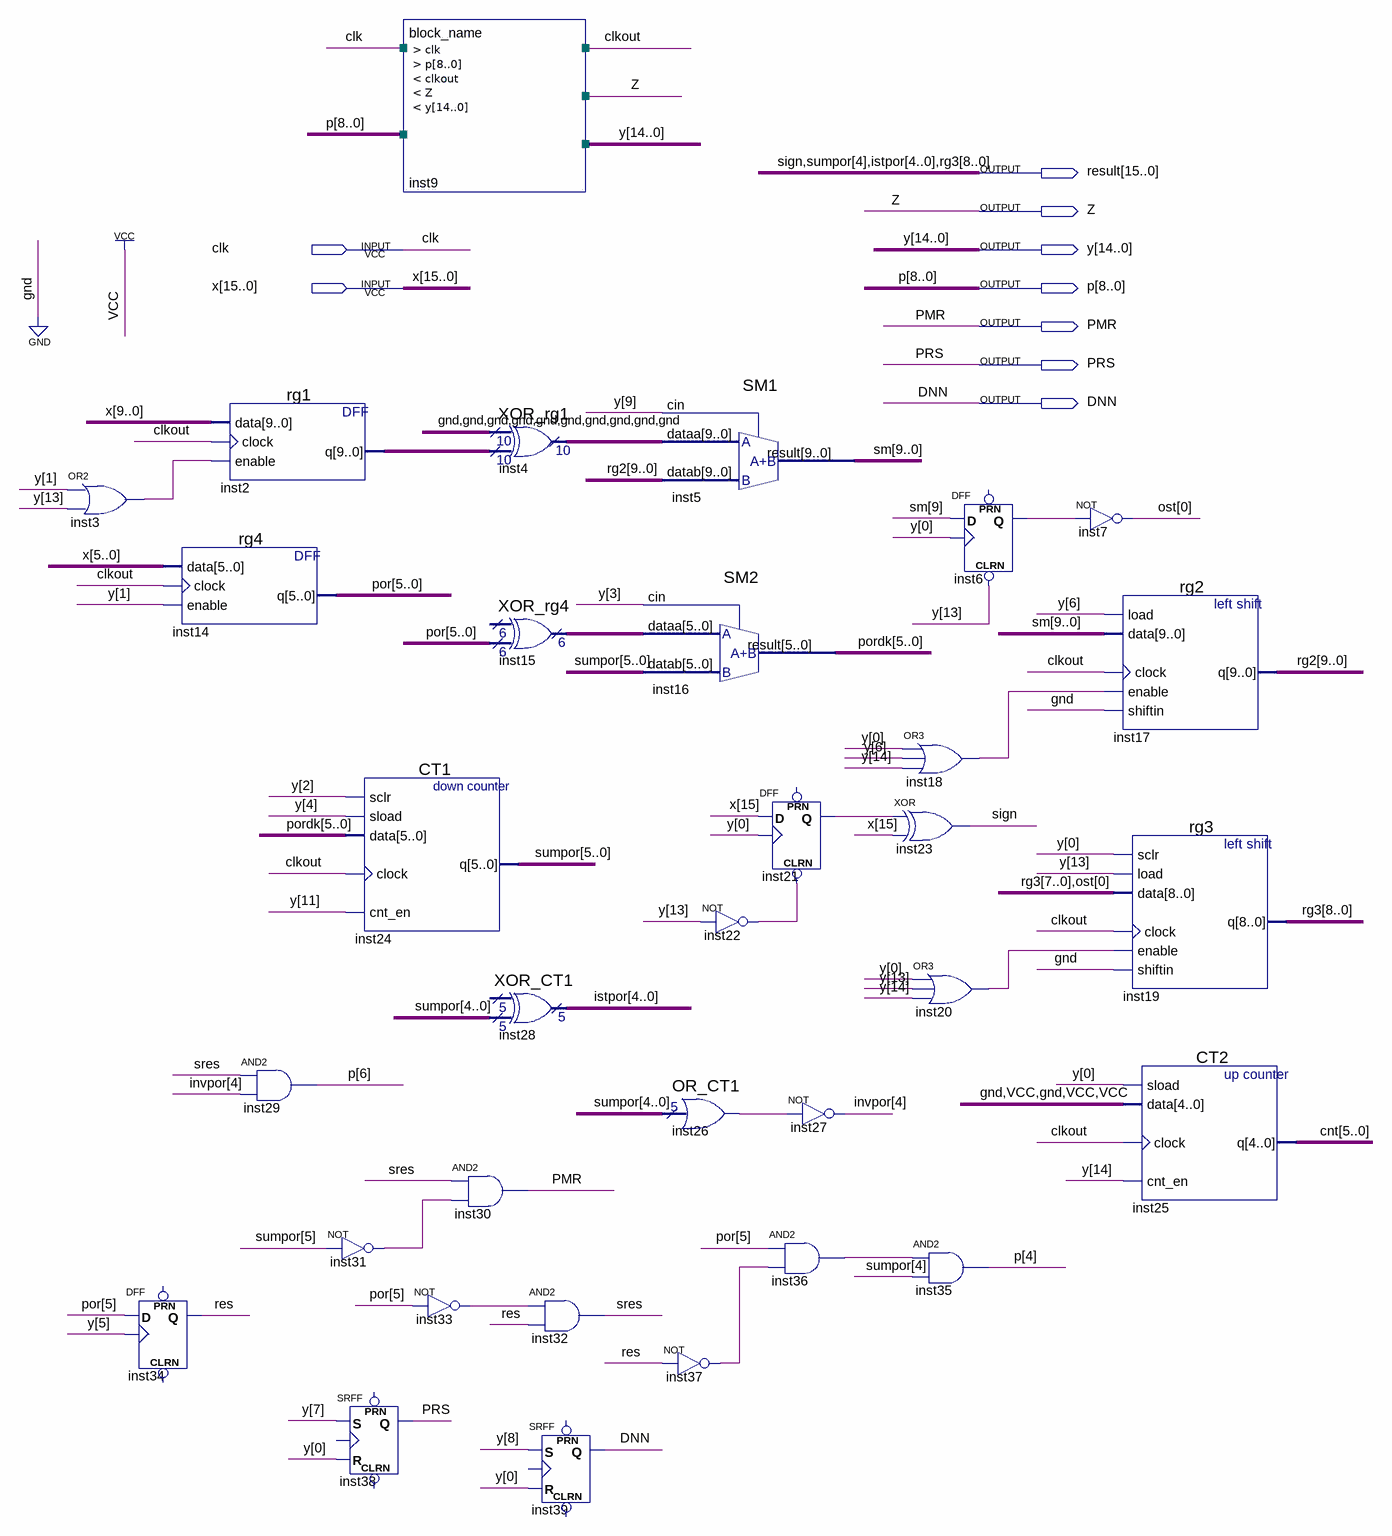
[diagram p0: schematic sheet]
// Quartus schematic kk.bdf as structural Verilog: 33 symbols, 9 pins
module kk (
  input  clk,
  input  [15:0] x,
  output [15:0] result,
  output Z,
  output [14:0] y,
  output [8:0] p,
  output PMR,
  output PRS,
  output DNN
);

  wire clkout, inst3_out, inst6_q, inst18_out, inst20_out, inst21_q, inst22_out, inst26_result, inst31_out,
       inst33_out, inst36_out, inst37_out, res, sres;
  wire [0:0] ost;
  wire [4:4] invpor;
  wire [5:0] cnt, inst15_result, por, pordk, sumpor;
  wire [9:0] inst2_q, inst4_result, rg2, sm;

  or inst3 (inst3_out, y[1], y[13]);
  rg4 inst14 (.data(x[5:0]), .clock(clkout), .enable(y[1]), .q(por));
  DFF inst34 (.CLK(y[5]), .D(por[5]), .Q(res));  // open: CLRN, PRN
  rg1 inst2 (.data(x[9:0]), .clock(clkout), .enable(inst3_out), .q(inst2_q));
  and inst29 (p[6], sres, invpor[4]);
  CT1 inst24 (
    .sclr(y[2]), .sload(y[4]), .data(pordk), .clock(clkout), .cnt_en(y[11]),
    .q({sumpor[5], result[14], sumpor[3:0]}));
  not inst31 (inst31_out, sumpor[5]);
  SRFF inst38 (.S(y[7]), .R(y[0]), .Q(PRS));  // open: PRN, CLRN, CLK
  block_name inst9 (.clk(clk), .p(p), .clkout(clkout), .Z(Z), .y(y));
  and inst30 (PMR, sres, inst31_out);
  not inst33 (inst33_out, por[5]);
  XOR_rg1 inst4 (.data0x({10{1'b0}}), .data1x(inst2_q), .result(inst4_result));
  XOR_rg4 inst15 (.data1x(por), .result(inst15_result));  // open: data0x
  XOR_CT1 inst28 (.data1x({result[14], sumpor[3:0]}), .result(result[13:9]));  // open: data0x
  and inst32 (sres, inst33_out, res);
  SRFF inst39 (.S(y[8]), .R(y[0]), .Q(DNN));  // open: PRN, CLRN, CLK
  SM1 inst5 (.dataa(inst4_result), .datab(rg2), .cin(y[9]), .result(sm));
  SM2 inst16 (.dataa(inst15_result), .datab({sumpor[5], result[14], sumpor[3:0]}), .cin(y[3]), .result(pordk));
  not inst22 (inst22_out, y[13]);
  OR_CT1 inst26 (.data({result[14], sumpor[3:0]}), .result(inst26_result));
  not inst37 (inst37_out, res);
  DFF inst21 (.CLRN(inst22_out), .CLK(y[0]), .D(x[15]), .Q(inst21_q));  // open: PRN
  and inst36 (inst36_out, por[5], inst37_out);
  not inst27 (invpor[4], inst26_result);
  or inst18 (inst18_out, y[0], y[6], y[14]);
  xor inst23 (result[15], inst21_q, x[15]);
  or inst20 (inst20_out, y[0], y[13], y[14]);
  and inst35 (p[4], inst36_out, result[14]);
  DFF inst6 (.CLRN(y[13]), .CLK(y[0]), .D(sm[9]), .Q(inst6_q));  // open: PRN
  not inst7 (ost[0], inst6_q);
  rg2 inst17 (.load(y[6]), .data(sm), .clock(clkout), .enable(inst18_out), .shiftin(1'b0), .q(rg2));
  rg3 inst19 (
    .sclr(y[0]), .load(y[13]), .data({result[7:0], ost[0]}), .clock(clkout), .enable(inst20_out),
    .shiftin(1'b0), .q(result[8:0]));
  CT2 inst25 (.sload(y[0]), .data(5'b01011), .clock(clkout), .cnt_en(y[14]), .q(cnt));

  // Other names for the same wires on the sheet: istpor[4:0] = result[13:9]; rg3[8:0] = result[8:0];
  //   sign = result[15]; sumpor[4] = result[14]
endmodule
